# EasyEDA schematic SCH_FINAL-Kickbots-joystick-2026-06-17.json
TITLE: Sheet_1; REV: 1.0; Date: 2026-01-25; Sheet: 1/1; Drawn By: liyanagenelithmav; Company: Your Company
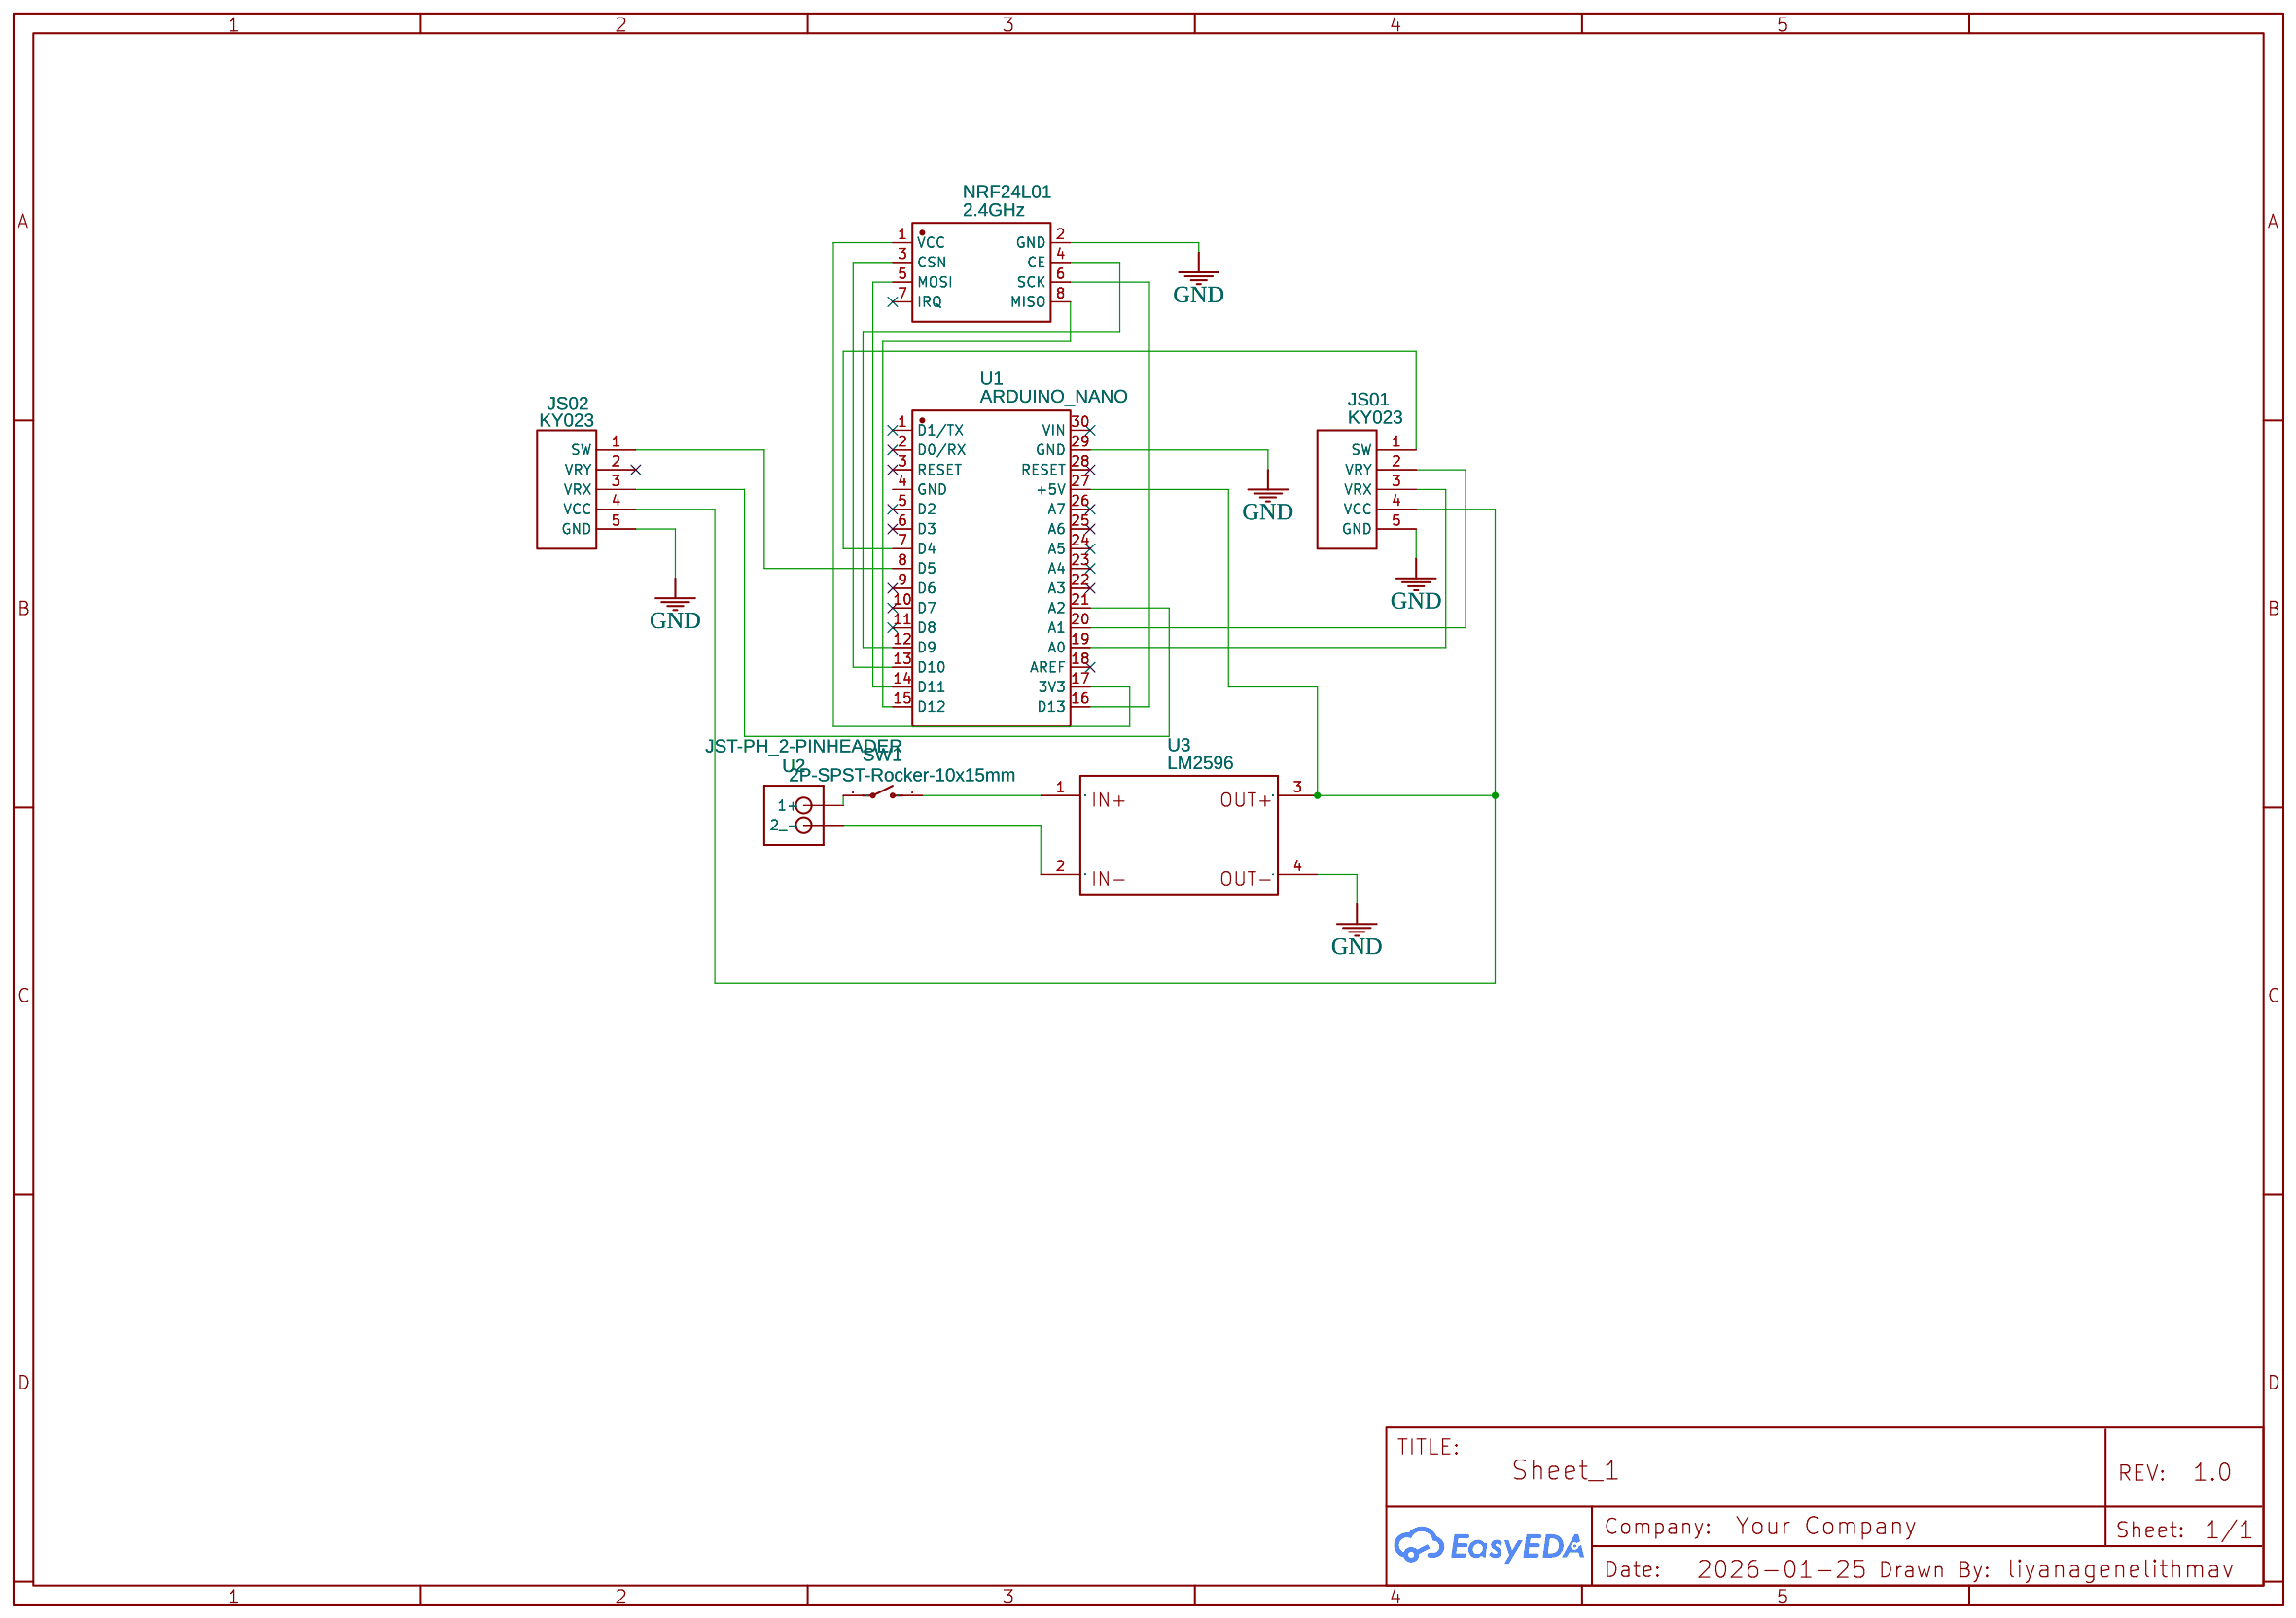
[diagram p0: schematic sheet]

## Parts
JS01  KY023  [KY023]
JS02  KY023  [KY023]
NRF24L01  2.4GHz  [WIRELM-SMD_L28.6-W15.3-P2.54_NRF24L01]
SW1  2P-SPST-Rocker-10x15mm  [SWITCH-2P-SPST-ROCKER-10X15MM]
U1  ARDUINO_NANO  [COMM-TH_ARDUINO_NANO]
U2  JST-PH_2-PINHEADER  [JST_B2B-PH_HEADER]
U3  LM2596  [LM2596DC_DC]

## Library data of the parts
JS01 JS02 = KY023: Contributor: Jack Emery
NRF24L01 = NRF24L01: Supplier: LCSC; Manufacturer: Ai-Thinker(安信可); Manufacturer Part: NF-04; Supplier Part: C90751; JLCPCB Part Class: Extended Part
SW1 = SWITCH-2P-SPST-Rocker-10x15mm: Manufacturer Part: KCD1-11-1.5x1cm; Supplier: Aliexpress; link: https://www.aliexpress.com/item/32920360920.html?spm=a2g0s.9042311.0.0.27424c4dCPvDQN; Contributor: shaman0
U1 = ARDUINO_NANO: Contributor: lcsc; Supplier: LCSC; Supplier Part: C9900017879; Manufacturer: null; JLCPCB Part Class: Extended Part
U2 = JST-PH_2-PIN_HEADER
U3 = LM2596: catid: 20; Contributor: utk.pekerjaan; sim: true

## Nets
GND: JS01.5(GND) JS02.5(GND) NRF24L01.2(GND) U1.29(GND) U3.4
Net-(JS01-1): JS01.1(SW) U1.7(D4)
Net-(JS01-2): JS01.2(VRY) U1.20(A1)
Net-(JS01-3): JS01.3(VRX) U1.19(A0)
Net-(JS01-4): JS01.4(VCC) JS02.4(VCC) U1.27(+5V) U3.3
Net-(JS02-1): JS02.1(SW) U1.8(D5)
Net-(JS02-3): JS02.3(VRX) U1.21(A2)
Net-(NRF24L01-1): NRF24L01.1(VCC) U1.17(3V3)
Net-(NRF24L01-3): NRF24L01.3(CSN) U1.13(D10)
Net-(NRF24L01-4): NRF24L01.4(CE) U1.12(D9)
Net-(NRF24L01-5): NRF24L01.5(MOSI) U1.14(D11)
Net-(NRF24L01-6): NRF24L01.6(SCK) U1.16(D13)
Net-(NRF24L01-8): NRF24L01.8(MISO) U1.15(D12)
Net-(SW1-1): SW1.1(O) U3.1
Net-(SW1-2): SW1.2(P) U2.P1(1+)
Net-(U2-P2): U2.P2(2 -) U3.2

Not connected (* = marked no-connect by the designer): JS02 2(VRY)*; NRF24L01 7(IRQ)*; U1 1(D1/TX)* 2(D0/RX)* 3(RESET)* 4(GND) 5(D2)* 6(D3)* 9(D6)* 10(D7)* 11(D8)* 18(AREF)* 22(A3)* 23(A4)* 24(A5)* 25(A6)* 26(A7)* 28(RESET)* 30(VIN)*
